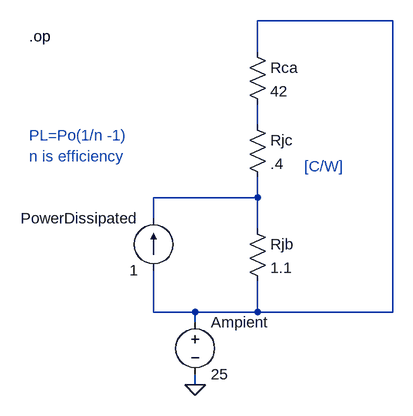
[diagram p0: schematic 01.simpleThermalModel.asc]
01.simpleThermalModel.asc, the LTspice schematic file:
Version 4
SHEET 1 880 680
WIRE 528 -144 320 -144
WIRE 320 -96 320 -144
WIRE 320 16 320 -16
WIRE 320 128 320 96
WIRE 320 128 160 128
WIRE 160 160 160 128
WIRE 320 176 320 128
WIRE 160 304 160 240
WIRE 224 304 160 304
WIRE 320 304 320 256
WIRE 320 304 224 304
WIRE 528 304 528 -144
WIRE 528 304 320 304
WIRE 224 320 224 304
WIRE 224 416 224 400
FLAG 224 416 0
DATAFLAG 224 128 ""
DATAFLAG 320 0 ""
DATAFLAG 320 -128 ""
SYMBOL current 160 240 R180
WINDOW 0 24 80 Left 2
WINDOW 3 24 0 Left 2
WINDOW 123 0 0 Left 0
WINDOW 39 0 0 Left 0
SYMATTR InstName PowerDissipated
SYMATTR Value 1
SYMBOL res 304 0 R0
SYMATTR InstName Rjc
SYMATTR Value .4
SYMBOL res 304 160 R0
SYMATTR InstName Rjb
SYMATTR Value 1.1
SYMBOL voltage 224 304 R0
SYMATTR InstName Ampient
SYMATTR Value 25
SYMBOL res 304 -112 R0
SYMATTR InstName Rca
SYMATTR Value 42
TEXT -32 32 Left 2 ;PL=Po(1/n -1)
TEXT -32 64 Left 2 ;n is efficiency
TEXT 392 80 Left 2 ;[C/W]
TEXT -32 -120 Left 2 !.op

The netlist it stands for:
* 01.simpleThermalModel.asc
I§PowerDissipated N001 N003 1
Rjc N002 N003 .4
Rjb N003 N001 1.1
V§Ampient N001 0 25
Rca N001 N002 42
* PL=Po(1/n -1)
* n is efficiency
* [C/W]
.op
.backanno
.end